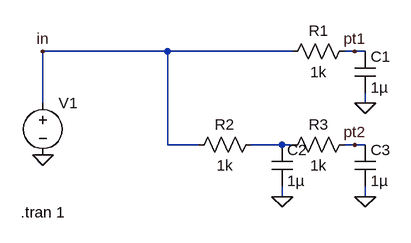
[diagram p0: schematic lt1_lt2.asc]
lt1_lt2.asc, the LTspice schematic file:
Version 4
SHEET 1 880 680
WIRE 128 32 -64 32
WIRE 320 32 128 32
WIRE 416 32 400 32
WIRE 432 32 416 32
WIRE -64 112 -64 32
WIRE 432 112 432 96
WIRE 128 176 128 32
WIRE 176 176 128 176
WIRE 304 176 256 176
WIRE 320 176 304 176
WIRE 416 176 400 176
WIRE 432 176 416 176
WIRE 304 256 304 240
WIRE 432 256 432 240
FLAG 432 112 0
FLAG -64 192 0
FLAG 304 256 0
FLAG 432 256 0
FLAG -64 32 in
FLAG 416 176 pt2
FLAG 416 32 pt1
SYMBOL voltage -64 96 R0
WINDOW 3 24 96 Invisible 2
WINDOW 123 0 0 Left 2
WINDOW 39 0 0 Left 2
SYMATTR InstName V1
SYMATTR Value PULSE(0 5 0 1n 1n 50u 100u)
SYMBOL res 304 48 R270
WINDOW 0 32 56 VTop 2
WINDOW 3 0 56 VBottom 2
SYMATTR InstName R1
SYMATTR Value 1k
SYMBOL res 160 192 R270
WINDOW 0 32 56 VTop 2
WINDOW 3 0 56 VBottom 2
SYMATTR InstName R2
SYMATTR Value 1k
SYMBOL res 304 192 R270
WINDOW 0 32 56 VTop 2
WINDOW 3 0 56 VBottom 2
SYMATTR InstName R3
SYMATTR Value 1k
SYMBOL cap 416 32 R0
SYMATTR InstName C1
SYMATTR Value 1µ
SYMBOL cap 288 176 R0
SYMATTR InstName C2
SYMATTR Value 1µ
SYMBOL cap 416 176 R0
SYMATTR InstName C3
SYMATTR Value 1µ
TEXT -98 280 Left 2 !.tran 1

The netlist it stands for:
* lt1_lt2.asc
V1 in 0 PULSE(0 5 0 1n 1n 50u 100u)
R1 in pt1 1k
R2 in N001 1k
R3 N001 pt2 1k
C1 pt1 0 1µ
C2 N001 0 1µ
C3 pt2 0 1µ
.tran 1
.backanno
.end